# Altium project Filter.PrjPcb
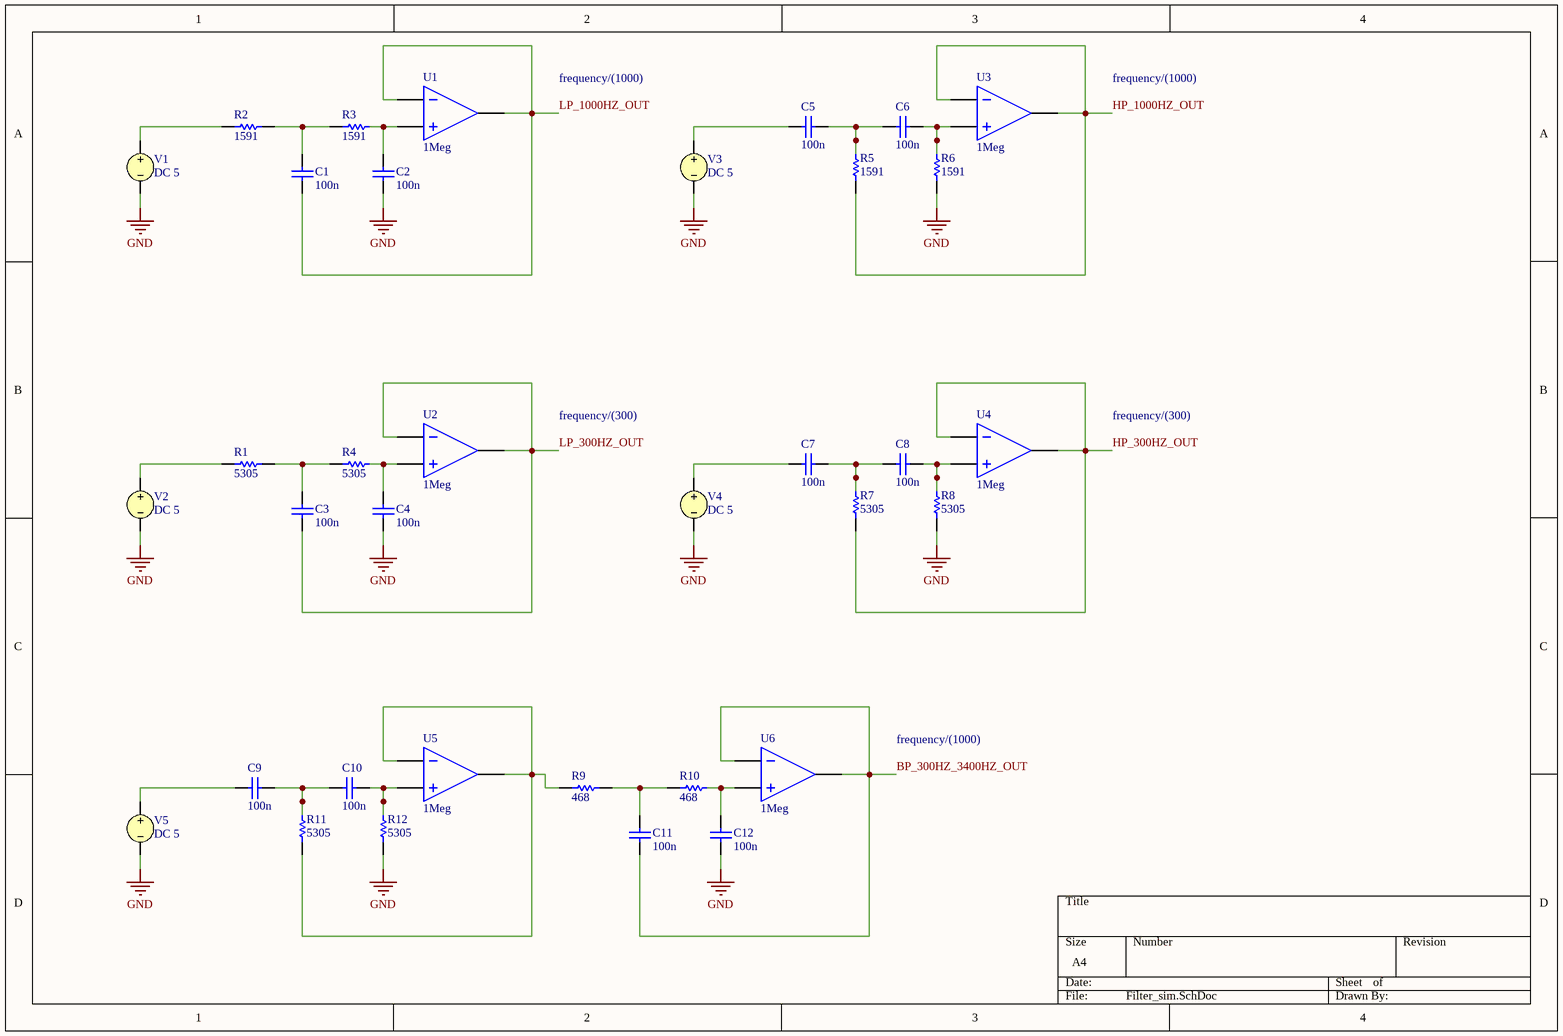
[diagram p0: Filter_sim.SchDoc]
1 sheet, 35 parts. Net scope: global (net labels, ports and power ports of the same name join across sheets).

## Sheet Filter_sim.SchDoc
size A4; SheetNumber: 1; SheetTotal: 1; SPICEModelCacheQSZUGKFO: <root> / <DocumentId>QSZUGKFO</DocumentId> / </root>

### Parts
C1  value 100n  (hidden comment: Capacitor)
C2  value 100n  (hidden comment: Capacitor)
C3  value 100n  (hidden comment: Capacitor)
C4  value 100n  (hidden comment: Capacitor)
C5  value 100n  (hidden comment: Capacitor)
C6  value 100n  (hidden comment: Capacitor)
C7  value 100n  (hidden comment: Capacitor)
C8  value 100n  (hidden comment: Capacitor)
C9  value 100n  (hidden comment: Capacitor)
C10  value 100n  (hidden comment: Capacitor)
C11  value 100n  (hidden comment: Capacitor)
C12  value 100n  (hidden comment: Capacitor)
R1  value 5305  (hidden comment: Resistor)
R2  value 1591  (hidden comment: Resistor)
R3  value 1591  (hidden comment: Resistor)
R4  value 5305  (hidden comment: Resistor)
R5  value 1591  (hidden comment: Resistor)
R6  value 1591  (hidden comment: Resistor)
R7  value 5305  (hidden comment: Resistor)
R8  value 5305  (hidden comment: Resistor)
R9  value 468  (hidden comment: Resistor)
R10  value 468  (hidden comment: Resistor)
R11  value 5305  (hidden comment: Resistor)
R12  value 5305  (hidden comment: Resistor)
U1  GAIN: 1Meg  (hidden comment: Ideal Operational Amplifier)
U2  GAIN: 1Meg  (hidden comment: Ideal Operational Amplifier)
U3  GAIN: 1Meg  (hidden comment: Ideal Operational Amplifier)
U4  GAIN: 1Meg  (hidden comment: Ideal Operational Amplifier)
U5  GAIN: 1Meg  (hidden comment: Ideal Operational Amplifier)
U6  GAIN: 1Meg  (hidden comment: Ideal Operational Amplifier)
V1  DC 5
V2  DC 5
V3  DC 5
V4  DC 5
V5  DC 5

### Nets
GND: C2.1 C4.1 C12.1 R6.2 R8.2 R12.2 V1.2 V2.2 V3.2 V4.2 V5.2
BP_300HZ_3400HZ_OUT: C11.2 U6.1(IN-) U6.3(OUT)
HP_300HZ_OUT: R7.2 U4.1(IN-) U4.3(OUT)
HP_1000HZ_OUT: R5.2 U3.1(IN-) U3.3(OUT)
LP_300HZ_OUT: C3.2 U2.1(IN-) U2.3(OUT)
LP_1000HZ_OUT: C1.2 U1.1(IN-) U1.3(OUT)
NetC1_1: C1.1 R2.1 R3.2
NetC2_2: C2.2 R3.1 U1.2(IN+)
NetC3_1: C3.1 R1.1 R4.2
NetC4_2: C4.2 R4.1 U2.2(IN+)
NetC5_1: C5.1 V3.1
NetC5_2: C5.2 C6.2 R5.1
NetC6_1: C6.1 R6.1 U3.2(IN+)
NetC7_1: C7.1 V4.1
NetC7_2: C7.2 C8.2 R7.1
NetC8_1: C8.1 R8.1 U4.2(IN+)
NetC9_1: C9.1 V5.1
NetC9_2: C9.2 C10.2 R11.1
NetC10_1: C10.1 R12.1 U5.2(IN+)
NetC11_1: C11.1 R9.1 R10.2
NetC12_2: C12.2 R10.1 U6.2(IN+)
NetR1_2: R1.2 V2.1
NetR2_2: R2.2 V1.1
NetR9_2: R9.2 R11.2 U5.1(IN-) U5.3(OUT)

### Notes on the sheet
- frequency/(1000)
- frequency/(300)

### Library data of the parts
C1-C12 = Capacitor: SimulationGenericComponent: True
R1-R12 = Resistor: TC1: 0; SimulationGenericComponent: True; TC2: 0
U1-U6 = OpAmp: SimulationGenericComponent: True
V1-V5 = VSRC: Voltage Source; Note: PCB Footprint - Not required; AC Magnitude: 1; AC Phase: 0; Value: 5; Published: 8-Jun-2000; LatestRevisionDate: 17-Jul-2002; LatestRevisionNote: Re-released for DXP Platform.; PackageReference: Not Applicable; Publisher: Altium Limited